# EAGLE design ic-tester (EAGLE 9.6.2)
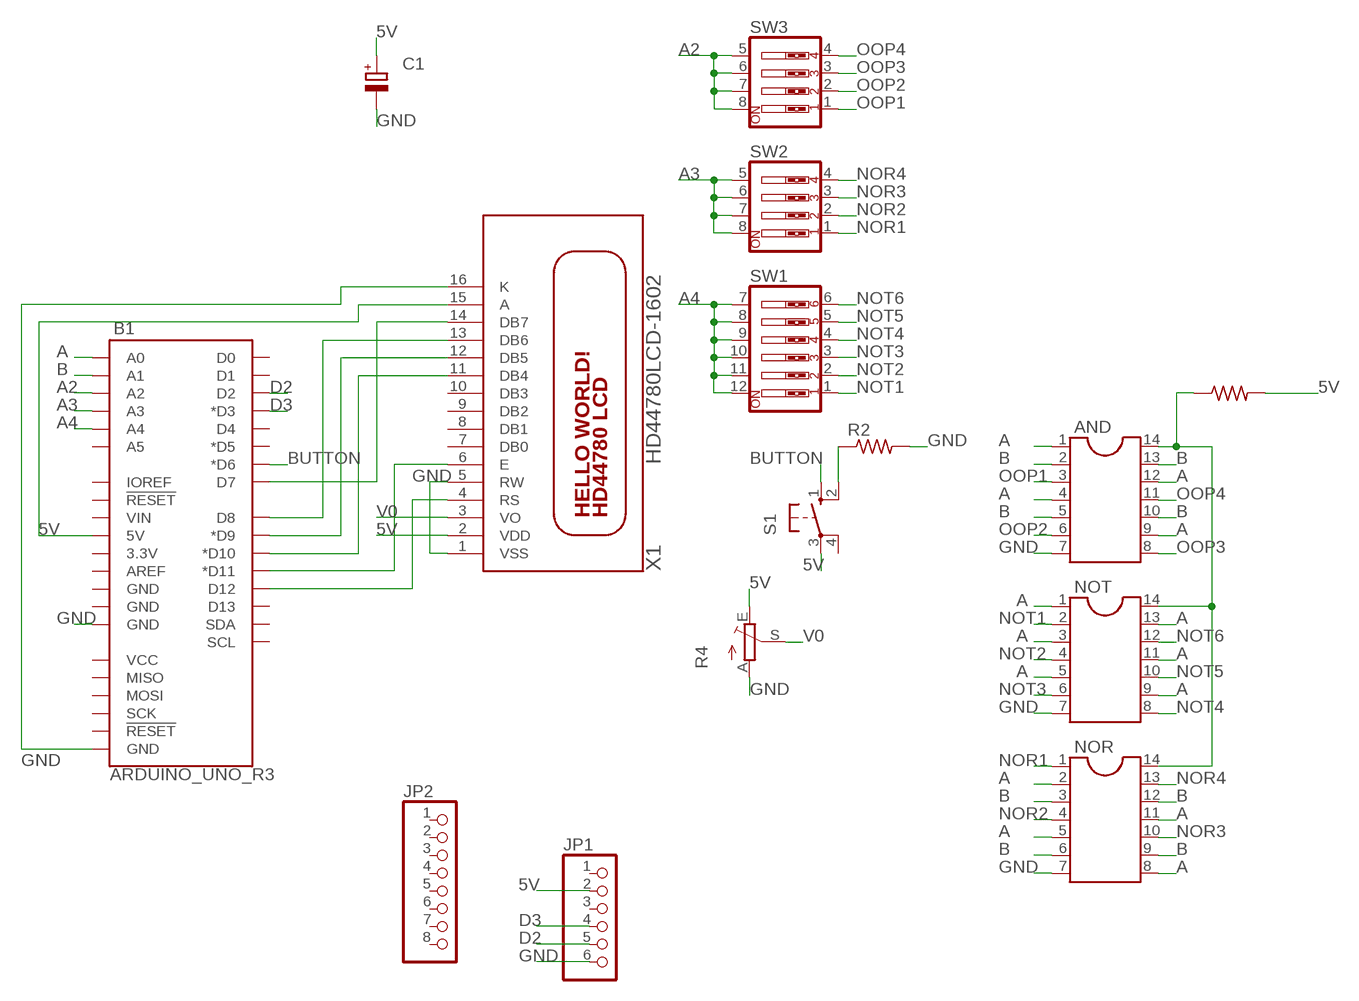
[diagram p0: schematic, sheet 1]

## Parts
AND  DIL14  [DIL14]
B1  ARDUINO_UNO_R3  [ARDUINO_R3]
C1  CPOL-EUE7.5-16  [E7,5-16]
JP1  PINHD-1X6  [1X06]
JP2  PINHD-1X8BIG  [1X08-BIG]
NOR  DIL14  [DIL14]
NOT  DIL14  [DIL14]
R1  R-US_0204/7  [0204/7]
R2  R-US_0204/7  [0204/7]
R4  TRIM_EU-LI10  [LI10]
S1  10-XX  [B3F-10XX]
SW1  SW_DIP-6  [EDG-06]
SW2  SW_DIP-4  [EDG-04]
SW3  SW_DIP-4  [EDG-04]
X1  HD44780LCD-1602  [LCD1602]

## Nets
5V: B1.5V C1.+ JP1.2 R1.2 R4.E S1.3(P) X1.2(VDD) X1.15(A)
A: AND.1 AND.4 AND.9 AND.12 B1.A0 NOR.2 NOR.5 NOR.8 NOR.11 NOT.1 NOT.3 NOT.5 NOT.9 NOT.11 NOT.13
A2: B1.A2 SW3.5 SW3.6 SW3.7 SW3.8
A3: B1.A3 SW2.5 SW2.6 SW2.7 SW2.8
A4: B1.A4 SW1.7 SW1.8 SW1.9 SW1.10 SW1.11 SW1.12
B: AND.2 AND.5 AND.10 AND.13 B1.A1 NOR.3 NOR.6 NOR.9 NOR.12
BUTTON: B1.D6(*D6) S1.1(S)
D2: B1.D2 JP1.5
D3: B1.D3(*D3) JP1.4
GND: AND.7 B1.GND@1(GND) B1.GND@2(GND) C1.- JP1.6 NOR.7 NOT.7 R2.2 R4.A X1.1(VSS) X1.5(RW) X1.16(K)
N$2: B1.D9(*D9) X1.12(DB5)
N$4: B1.D7 X1.14(DB7)
N$5: R2.1 S1.2(S1)
N$30: B1.D8 X1.13(DB6)
N$32: B1.D10(*D10) X1.11(DB4)
N$33: B1.D11(*D11) X1.6(E)
N$34: B1.D12 X1.4(RS)
N$94: AND.14 NOR.14 NOT.14 R1.1
NOR1: NOR.1 SW2.1
NOR2: NOR.4 SW2.2
NOR3: NOR.10 SW2.3
NOR4: NOR.13 SW2.4
NOT1: NOT.2 SW1.1
NOT2: NOT.4 SW1.2
NOT3: NOT.6 SW1.3
NOT4: NOT.8 SW1.4
NOT5: NOT.10 SW1.5
NOT6: NOT.12 SW1.6
OOP1: AND.3 SW3.1
OOP2: AND.6 SW3.2
OOP3: AND.8 SW3.3
OOP4: AND.11 SW3.4
V0: R4.S X1.3(VO)
Unconnected: B1.3.3V B1.A5 B1.AREF B1.D0 B1.D1 B1.D4 B1.D5(*D5) B1.D13 B1.GND@3(GND) B1.GND@4(GND) B1.IOREF B1.MISO B1.MOSI B1.RESET@1(!RESET!) B1.RESET@2(!RESET!) B1.SCK B1.SCL B1.SDA B1.VCC B1.VIN JP1.1 JP1.3 JP2.1 JP2.2 JP2.3 JP2.4 JP2.5 JP2.6 JP2.7 JP2.8 S1.4(P1) X1.7(DB0) X1.8(DB1) X1.9(DB2) X1.10(DB3)

## Library data of the parts
AND NOR NOT = ic-package:DIL14: Dual In Line / Socket
B1 = SparkFun-Boards:ARDUINO_UNO_R3: Arduino R3 Footprint with SPI header Arduino Uno R3 Compatible Footprint. Matches PCB size of the original board. SparkFun Products: SAMD21 Dev Breakout <https://www.sparkfun.com/products/13672> RedBoard <https://www.sparkfun.com/products/12757> R3 Stackable Headers <https://www.sparkfun.com/products/11417>
C1 = resistor:CPOL-EU: POLARIZED CAPACITOR, European symbol
JP1 = adafruit:PINHD-1X6: PIN HEADER
JP2 = adafruit:PINHD-1X8: PIN HEADER
R1 R2 = adafruit:R-US_: RESISTOR, American symbol
R4 = pot:TRIM_EU-: POTENTIOMETER
S1 = switch-omron:10-XX: OMRON SWITCH; MPN: B3F-1000; OC_FARNELL: 176432; OC_NEWARK: 36M3542
SW1 = special:SW_DIP-6: DIP SWITCH
SW2 SW3 = special:SW_DIP-4: DIP SWITCH
X1 = adafruit:HD44780LCD: HD44780 LCD Standard character type LCDs, available in sizes from 8x1 to 40x4!

## Net classes
0 default: width 0.762 mm, drill 0.762 mm, clearance 0.762 mm

## Board
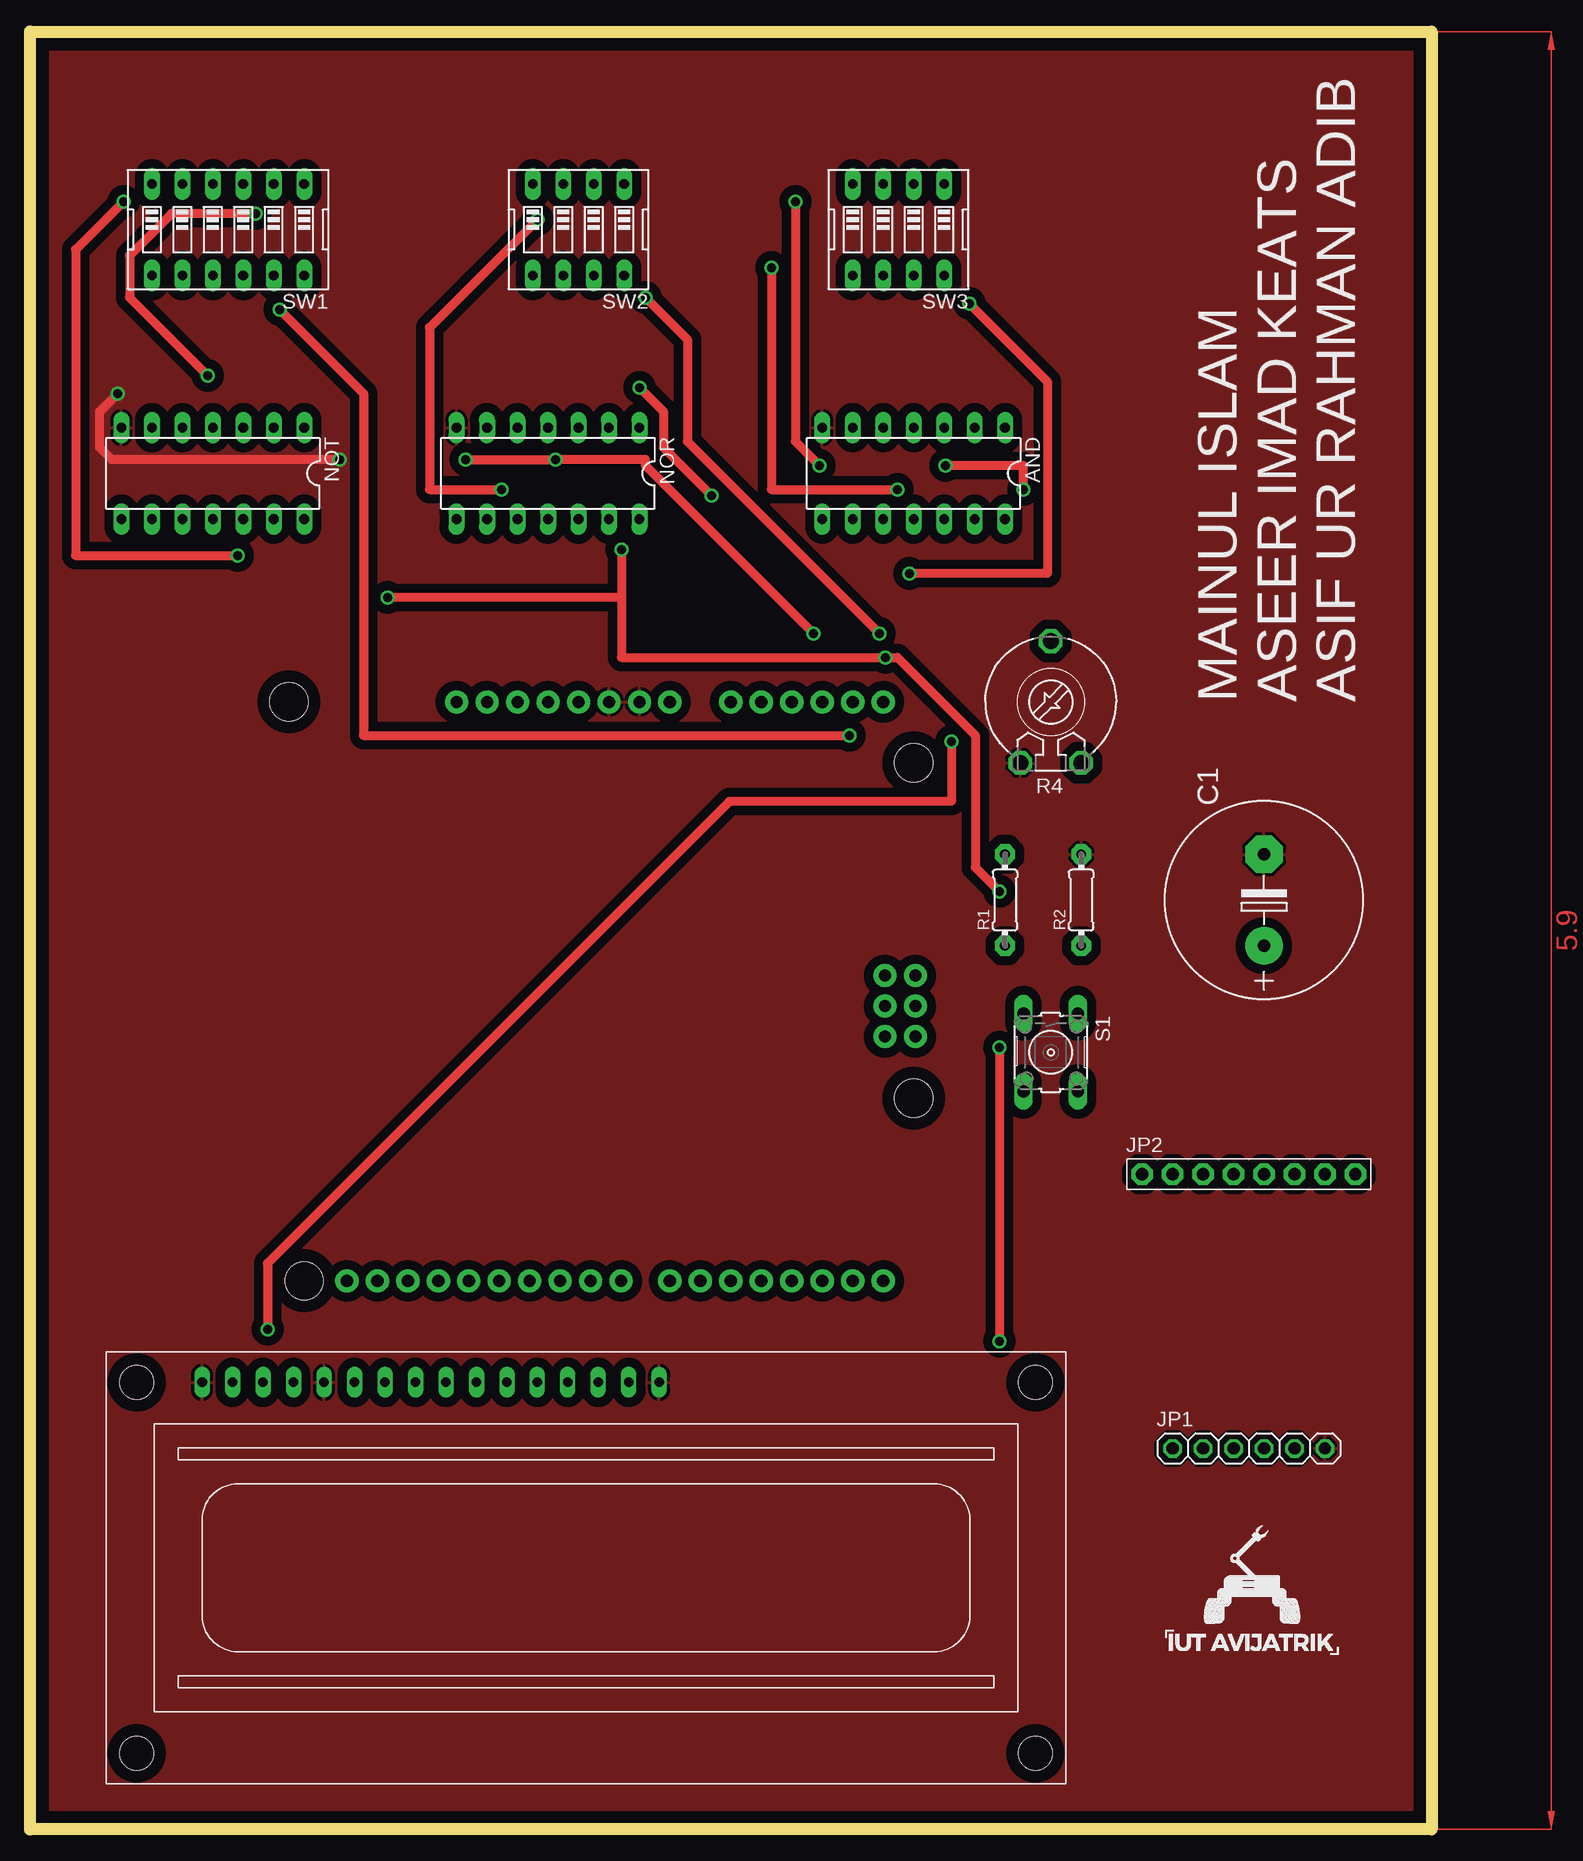
[diagram p1: board, top side]
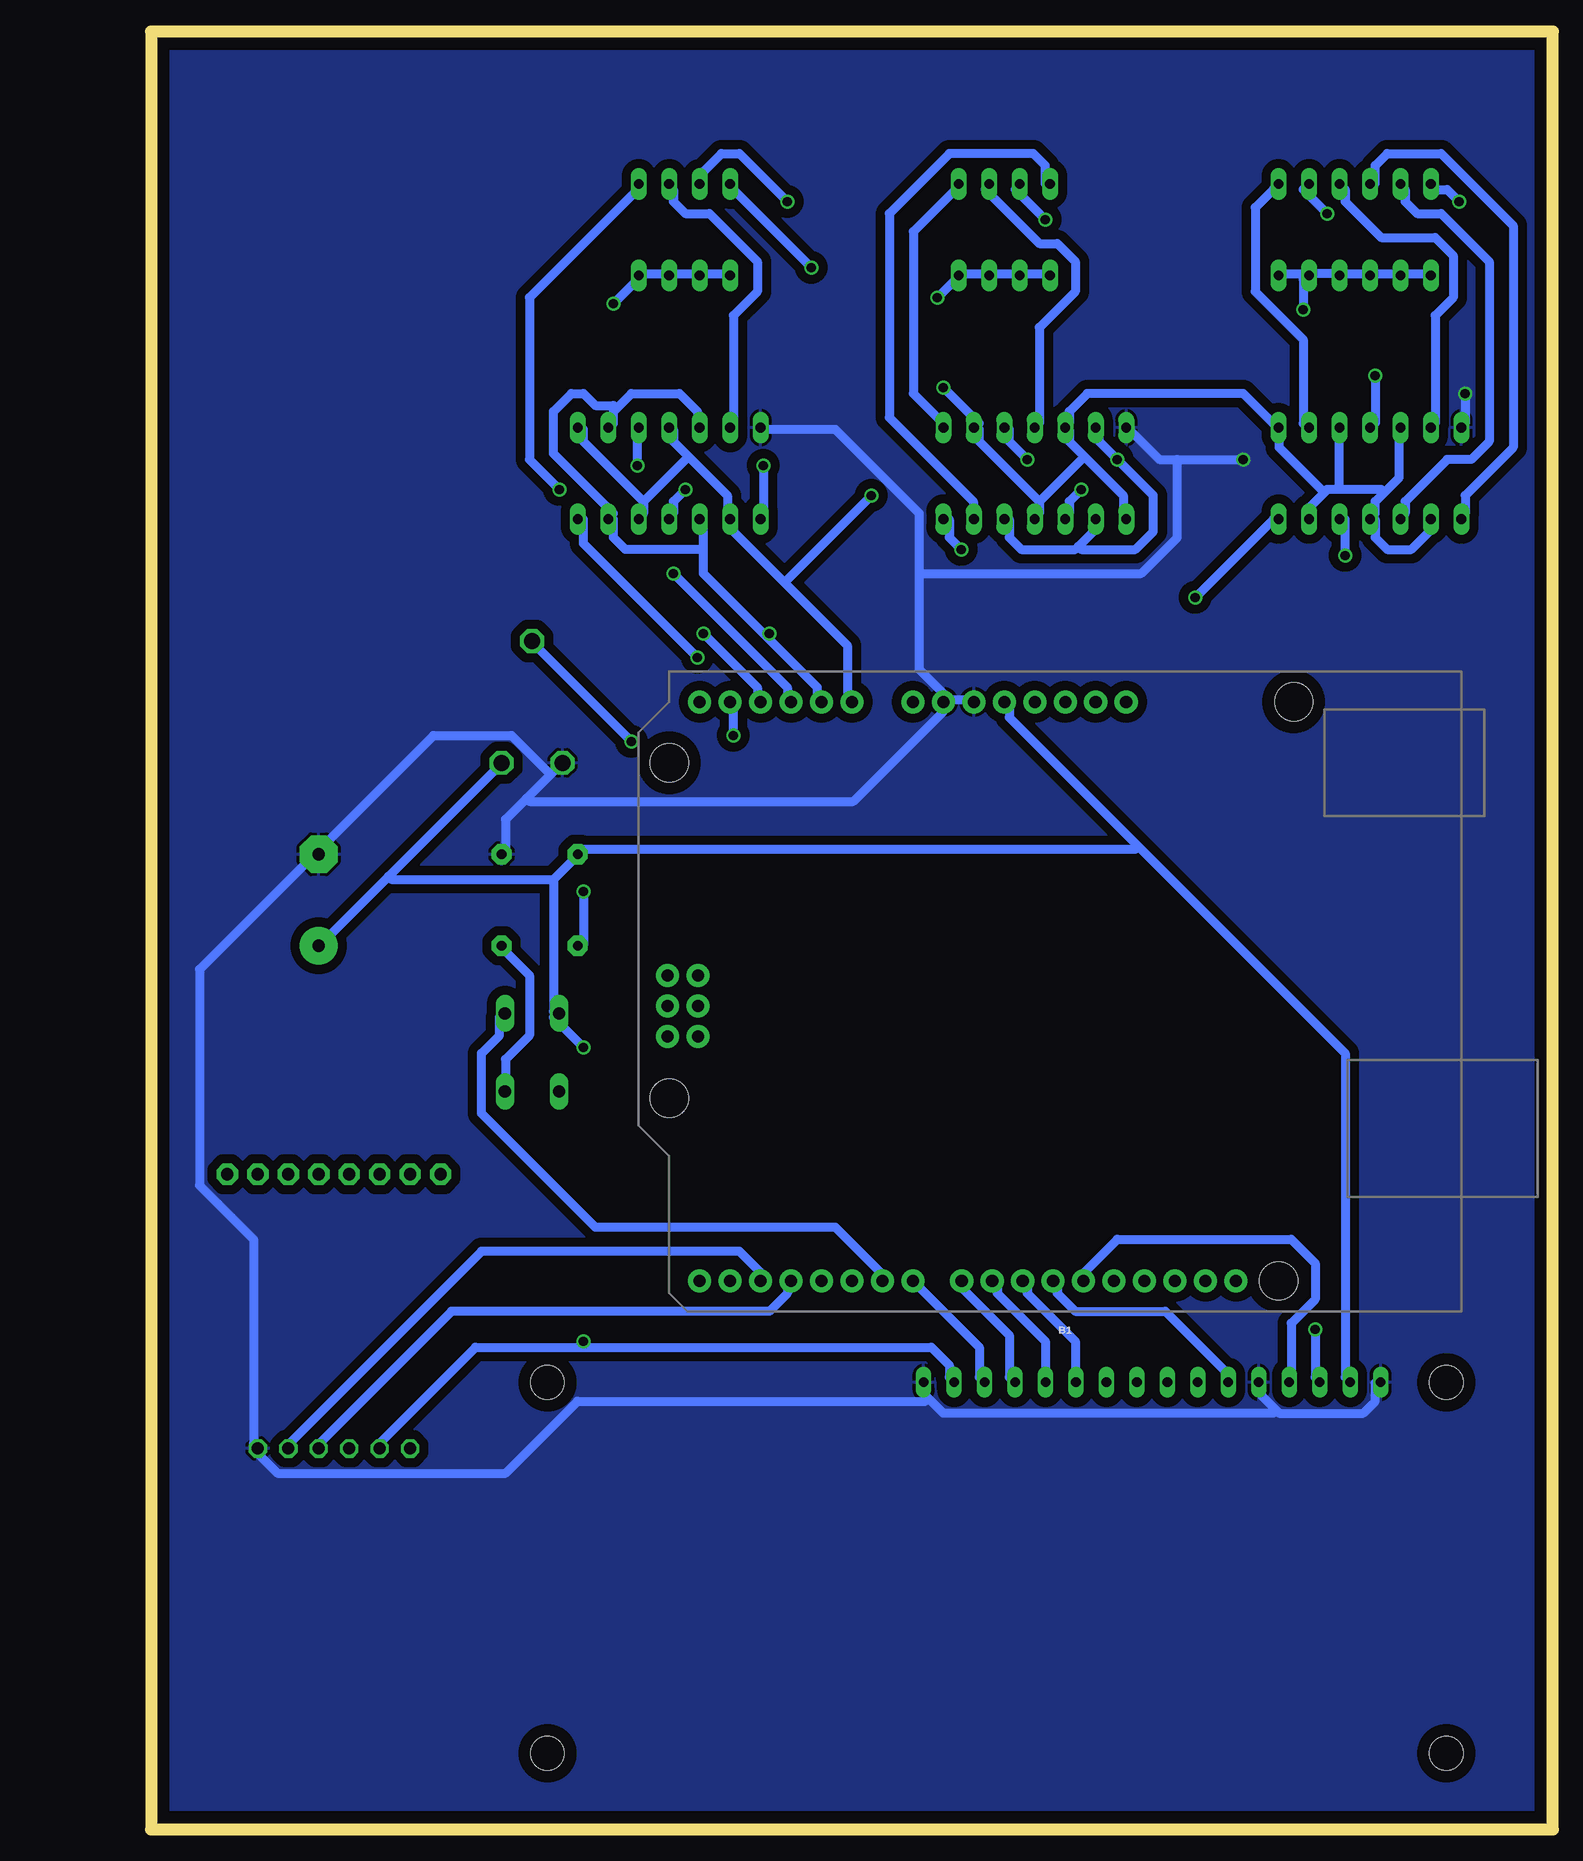
[diagram p2: board, bottom side, seen from below]

Size 116.84 x 149.86 mm. Coordinates in mm from the lower left corner, seen from the top.
Outline: 0,149.86 116.84,149.86 116.84,0 0,0 0,149.86
Copper layers (1*16): Top 0.035mm / dielectric 1.5mm / Bottom 0.035mm
Design rules "default *": minimum track width 30mil, minimum drill 0.45mm, track to track 30mil, track to pad 30mil, pad to pad 30mil, via to via 30mil, smd to smd 30mil, copper to edge 40mil, drill to drill 30mil, minimum pad ring 10mil, minimum via ring 8mil, stop-mask expansion 4mil, vias tented up to drill 0mil, thermal gap 10mil

### Footprints (pad centres in the part's own frame; a part is rotated, then mirrored left to right if it is on the bottom)
DIL14 = drill 0.813 long: 1 -7.62,-3.81; 2 -5.08,-3.81; 3 -2.54,-3.81; 4 0,-3.81; 5 2.54,-3.81; 6 5.08,-3.81; 7 7.62,-3.81; 8 7.62,3.81; 9 5.08,3.81; 10 2.54,3.81; 11 0,3.81; 12 -2.54,3.81; 13 -5.08,3.81; 14 -7.62,3.81
ARDUINO_R3 = drill 1.016 pad 1.93: 3.3V 2.54,-24.13; 5V 5.08,-24.13; A0 17.78,-24.13; A1 20.32,-24.13; A2 22.86,-24.13; A3 25.4,-24.13; A4 27.94,-24.13; A5 30.48,-24.13; AREF -9.144,24.13; D0 30.48,24.13; D1 27.94,24.13; D2 25.4,24.13; D3 22.86,24.13; D4 20.32,24.13; D5 17.78,24.13; D6 15.24,24.13; D7 12.7,24.13; D8 8.636,24.13; D9 6.096,24.13; D10 3.556,24.13; D11 1.016,24.13; D12 -1.524,24.13; D13 -4.064,24.13; GND@1 7.62,-24.13; GND@2 10.16,-24.13; GND@3 -6.604,24.13; GND@4 33.16,-1.32; IOREF -2.54,-24.13; MISO 30.62,3.76; MOSI 33.16,1.22; NC -5.08,-24.13; RESET@1 0,-24.13; RESET@2 30.62,-1.32; SCK 30.62,1.22; SCL -14.224,24.13; SDA -11.684,24.13; VCC 33.16,3.76; VIN 12.7,-24.13 | hole 3.175: -17.78,24.13; 33.02,8.89; 33.02,-19.05; -19.05,-24.13
E7,5-16 = drill 1.016 pad 3.15: + -3.81,0 | drill 1.016 pad 3.15 octagon: - 3.81,0
1X06 = drill 1.016 octagon: 1 -6.35,0; 2 -3.81,0; 3 -1.27,0; 4 1.27,0; 5 3.81,0; 6 6.35,0
1X08-BIG = drill 1.016 pad 1.778 octagon: 1 -8.89,0; 2 -6.35,0; 3 -3.81,0; 4 -1.27,0; 5 1.27,0; 6 3.81,0; 7 6.35,0; 8 8.89,0
0204/7 = drill 0.813 pad 1.676 octagon: 1 -3.81,0; 2 3.81,0
LI10 = drill 1.321 octagon: A -2.54,-5.08; E 2.54,-5.08; S 0,5.08
B3F-10XX = drill 1.016 long: 1 -3.251,2.261; 2 3.251,2.261; 3 -3.251,-2.261; 4 3.251,-2.261
EDG-06 = drill 0.813 long: 1 -6.35,-3.81; 2 -3.81,-3.81; 3 -1.27,-3.81; 4 1.27,-3.81; 5 3.81,-3.81; 6 6.35,-3.81; 7 6.35,3.81; 8 3.81,3.81; 9 1.27,3.81; 10 -1.27,3.81; 11 -3.81,3.81; 12 -6.35,3.81
EDG-04 = drill 0.813 long: 1 -3.81,-3.81; 2 -1.27,-3.81; 3 1.27,-3.81; 4 3.81,-3.81; 5 3.81,3.81; 6 1.27,3.81; 7 -1.27,3.81; 8 -3.81,3.81
LCD1602 = drill 0.8 long: 1 8,33.46; 2 10.54,33.46; 3 13.08,33.46; 4 15.62,33.46; 5 18.16,33.46; 6 20.7,33.46; 7 23.24,33.46; 8 25.78,33.46; 9 28.32,33.46; 10 30.86,33.46; 11 33.4,33.46; 12 35.94,33.46; 13 38.48,33.46; 14 41.02,33.46; 15 43.56,33.46; 16 46.1,33.46 | hole 2.8: 2.54,2.54; 2.54,33.46; 77.46,33.46; 77.46,2.54

### Placement (x,y rotation side)
AND  73.66,113.03 180 top
B1  40.64,69.85 180 bottom
C1  102.87,77.47 90 top
JP1  101.6,31.75 0 top
JP2  101.6,54.61 0 top
NOR  43.18,113.03 180 top
NOT  15.24,113.03 180 top
R1  81.28,77.47 90 top
R2  87.63,77.47 90 top
R4  85.09,93.98 0 top
S1  85.09,64.77 270 top
SW1  16.51,133.35 180 top
SW2  45.72,133.35 180 top
SW3  72.39,133.35 180 top
U$1  [AVIJATRIK]  101.6,17.78 0 top
X1  6.35,3.81 0 top

### Tracks (layer width: path | path; a pad name or v marks a point on that pad's centre or on a via)
5V  (via drill 0.76)
  Top 0.762: v80.81,65.19 v80.81,40.69
  Bottom 0.762: 80.81,40.19 89.81,40.19 97.81,32.19 JP1.2 | 80.81,40.19 51.81,40.19 50.31,38.69 50.31,37.69 X1.15 | 83.31,79.19 83.31,68.19 S1.3 83.31,67.69 v80.81,65.19 | 83.31,79.19 81.31,81.19 R1.2 80.81,81.69 34.81,81.69 34.56,81.94 | 97.06,79.44 102.81,73.69 C1.+ | 97.06,79.44 87.81,88.69 R4.E | 83.31,79.19 96.81,79.19 97.06,79.44 | 34.56,81.94 45.31,92.69 45.31,93.69 B1.5V | 34.56,81.94 17.31,64.69 17.31,37.69 X1.2 | v80.81,40.69 80.81,40.19
A  (via drill 0.76)
  Top 0.762: v56.81,111.19 52.81,115.19 52.81,118.19 v50.81,120.19
  Bottom 0.762: 72.06,114.44 73.31,115.69 73.31,116.69 AND.4 | 72.06,114.44 68.81,111.19 68.81,109.69 AND.9 68.31,109.19 68.31,108.19 64.06,103.94 | 75.81,110.69 75.81,109.69 AND.12 | 72.06,114.44 75.81,110.69 | 75.81,110.69 80.81,115.69 80.81,116.69 AND.1 | 64.06,103.94 58.81,98.69 58.81,94.19 B1.A0 | 39.06,114.44 40.31,115.69 40.31,116.69 NOR.5 40.31,117.19 40.31,118.19 38.81,119.69 25.81,119.69 23.31,117.19 NOT.1 22.81,116.69 22.81,115.19 19.06,111.44 | 39.06,114.44 35.81,111.19 35.81,109.69 NOR.8 | 42.81,110.69 42.81,109.69 NOR.11 | 39.06,114.44 42.81,110.69 | 42.81,110.69 47.81,115.69 47.81,116.69 NOR.2 47.81,117.19 v50.81,120.19 | NOT.9 10.31,109.19 10.31,108.19 11.81,106.69 13.81,106.69 14.81,107.69 14.81,109.19 NOT.11 14.81,109.69 14.81,110.69 14.06,111.44 | 14.06,111.44 12.81,112.69 12.81,116.69 NOT.5 | 19.06,111.44 18.81,111.69 17.81,111.69 | 19.06,111.44 20.31,110.19 20.31,109.69 NOT.13 | 17.81,111.69 14.31,111.69 14.06,111.44 | 17.81,111.69 17.81,116.69 NOT.3 | v56.81,111.19 64.06,103.94
A2  (via drill 0.76)
  Top 0.762: v73.31,104.69 84.81,104.69 84.81,120.69 v78.31,127.19
  Bottom 0.762: SW3.5 68.81,129.69 70.81,129.69 SW3.6 71.31,129.69 73.31,129.69 SW3.7 73.81,129.69 75.81,129.69 SW3.8 76.31,129.19 v78.31,127.19 | v73.31,104.69 63.81,95.19 63.81,94.19 B1.A2
A3  (via drill 0.76)
  Top 0.762: v70.81,99.69 54.81,115.69 54.81,124.19 v51.31,127.69
  Bottom 0.762: SW2.5 42.31,129.69 44.31,129.69 SW2.6 44.81,129.69 46.81,129.69 SW2.7 47.31,129.69 49.31,129.69 SW2.8 49.81,129.19 v51.31,127.69 | v70.81,99.69 66.31,95.19 66.31,94.19 B1.A3
A4  (via drill 0.76)
  Top 0.762: v68.31,91.19 27.81,91.19 27.81,119.69 v20.81,126.69
  Bottom 0.762: SW1.11 20.81,129.69 22.81,129.69 SW1.12 | SW1.7 10.31,129.69 12.31,129.69 SW1.8 12.81,129.69 14.81,129.69 SW1.9 15.31,129.69 17.31,129.69 SW1.10 17.81,129.69 20.31,129.69 SW1.11 | v68.31,91.19 68.31,93.69 B1.A4 | v20.81,126.69 20.81,129.19 SW1.11
B  (via drill 0.76)
  Top 0.762: v36.31,114.19 v43.81,114.19 51.31,114.19 51.31,113.69 v65.31,99.69
  Bottom 0.762: 39.56,106.94 39.81,106.69 44.31,106.69 45.31,107.69 45.31,109.19 NOR.12 | 39.56,106.94 38.31,108.19 38.31,109.19 NOR.9 | NOR.6 37.81,116.69 37.81,115.69 v36.31,114.19 33.31,111.19 33.31,108.19 34.81,106.69 39.31,106.69 39.56,106.94 | v43.81,114.19 45.31,115.69 45.31,116.69 NOR.3 | 78.06,118.44 78.31,118.19 78.31,117.19 AND.2 | 78.06,118.44 76.81,119.69 72.81,119.69 71.31,118.19 71.31,117.19 AND.5 | 70.81,106.69 70.81,104.69 65.56,99.44 | 70.81,106.69 70.81,109.19 AND.10 | 65.56,99.44 61.31,95.19 61.31,94.19 B1.A1 | 70.81,106.69 77.31,106.69 78.31,107.69 78.31,109.19 AND.13 78.31,109.69 83.31,114.69 83.31,118.19 81.81,119.69 80.81,119.69 79.81,118.69 78.31,118.69 78.06,118.44 | v65.31,99.69 65.56,99.44
BUTTON
  Bottom 0.762: S1.1 87.81,67.69 87.81,66.19 89.31,64.69 89.31,59.69 79.81,50.19 59.81,50.19 55.81,46.19 B1.D6
D2
  Bottom 0.762: JP1.5 105.31,32.19 89.31,48.19 67.81,48.19 65.81,46.19 B1.D2
D3
  Bottom 0.762: JP1.4 102.81,32.19 91.81,43.19 65.31,43.19 63.81,44.69 63.81,45.69 B1.D3
GND  (via drill 0.76)
  Top 0.762: v7.31,119.69 5.81,118.19 5.81,115.19 6.81,114.19 v25.81,114.19
  Bottom 0.762: v7.31,119.69 7.31,117.19 NOT.7 | 31.31,114.19 32.81,114.19 35.31,116.69 NOR.7 | 31.31,114.19 v25.81,114.19 | 52.81,104.69 52.81,96.69 50.31,94.19 | 52.81,104.69 52.81,109.69 59.81,116.69 65.81,116.69 AND.7 | 50.31,94.19 48.31,94.19 B1.GND@1 | 50.31,94.19 B1.GND@2 50.81,93.69 50.81,93.19 58.31,85.69 85.31,85.69 85.56,85.94 | 31.31,114.19 31.31,107.69 34.31,104.69 52.81,104.69 | 23.06,34.94 24.31,36.19 24.31,37.19 X1.5 | 23.06,34.94 22.81,34.69 15.81,34.69 14.81,35.69 14.81,37.19 X1.1 | 52.06,35.94 50.81,34.69 23.31,34.69 23.06,34.94 | 52.06,35.94 52.31,36.19 52.31,37.19 X1.16 | 83.56,87.94 82.81,88.69 R4.A | 83.56,87.94 85.56,85.94 | 85.56,85.94 87.31,84.19 87.31,81.69 R2.2 | 83.56,87.94 86.81,91.19 93.31,91.19 102.81,81.69 C1.- 103.31,81.19 112.81,71.69 112.81,53.69 108.31,49.19 108.31,32.19 JP1.6 108.31,31.69 106.31,29.69 87.31,29.69 81.31,35.69 52.31,35.69 52.06,35.94
  pour Bottom: -0.09,149.99 -0.09,-0.01 116.61,-0.01 116.61,149.99
  pour Top: 1.11,148.79 115.71,148.79 115.71,-0.41 1.11,-0.41
N$2
  Bottom 0.762: X1.12 42.31,37.69 42.31,40.69 46.31,44.69 46.31,45.69 B1.D9
N$4
  Bottom 0.762: B1.D7 47.81,40.19 47.81,37.69 X1.14
N$5
  Bottom 0.762: S1.2 87.31,61.69 87.31,64.19 85.31,66.19 85.31,71.19 87.31,73.19 R2.1
N$30
  Bottom 0.762: X1.13 45.31,37.69 45.31,41.19 49.31,45.19 49.31,45.69 B1.D8
N$32
  Bottom 0.762: X1.11 39.81,37.69 39.81,40.69 43.81,44.69 43.81,45.69 B1.D10
N$33
  Bottom 0.762: X1.6 27.31,37.69 27.31,38.19 32.31,43.19 39.81,43.19 41.31,44.69 41.31,45.69 B1.D11
N$34
  Bottom 0.762: X1.4 21.81,37.69 21.81,42.19 19.81,44.19 19.81,47.19 21.81,49.19 36.31,49.19 39.31,46.19 B1.D12
N$94  (via drill 0.76)
  Top 0.762: 49.31,102.69 v29.81,102.69 | v49.31,106.69 49.31,102.69 | 49.31,102.69 49.31,97.69 v71.31,97.69 72.31,97.69 78.81,91.19 78.81,80.19 v80.81,78.19
  Bottom 0.762: v29.81,102.69 23.31,109.19 NOT.14 | v49.31,106.69 50.31,107.69 50.31,109.19 NOR.14 | v71.31,97.69 80.81,107.19 80.81,109.19 AND.14 | v80.81,78.19 80.81,73.69 R1.1
NOR1
  Bottom 0.762: NOR.1 50.81,117.19 53.31,119.69 53.31,133.19 49.81,136.69 SW2.1
NOR2
  Bottom 0.762: NOR.4 42.81,117.19 42.81,125.19 39.81,128.19 39.81,130.69 41.31,132.19 42.81,132.19 47.31,136.69 SW2.2
NOR3  (via drill 0.76)
  Top 0.762: v39.31,111.69 33.31,111.69 33.31,125.19 v42.31,134.19
  Bottom 0.762: v39.31,111.69 40.31,110.69 40.31,109.69 NOR.10 | v42.31,134.19 44.81,136.69 SW2.3
NOR4
  Bottom 0.762: NOR.13 48.31,109.69 48.31,110.69 55.31,117.69 55.31,134.69 50.31,139.69 43.31,139.69 42.31,138.69 42.31,137.19 SW2.4
NOT1
  Bottom 0.762: NOT.2 20.81,117.19 20.81,124.19 24.81,128.19 24.81,135.19 23.31,136.69 SW1.1
NOT2  (via drill 0.76)
  Top 0.762: v14.81,121.19 8.31,127.69 8.31,131.19 11.81,134.69 v18.81,134.69
  Bottom 0.762: v14.81,121.19 14.81,117.19 NOT.4 | v18.81,134.69 20.81,136.69 SW1.2
NOT3
  Bottom 0.762: NOT.6 9.81,117.19 9.81,126.19 8.31,127.69 8.31,131.19 9.81,132.69 14.31,132.69 17.31,135.69 17.31,136.69 SW1.3
NOT4
  Bottom 0.762: NOT.8 7.31,109.69 7.31,111.19 3.31,115.19 3.31,133.69 9.31,139.69 13.81,139.69 14.81,138.69 14.81,137.19 SW1.4
NOT5
  Bottom 0.762: NOT.10 12.31,109.69 12.31,110.69 8.81,114.19 6.81,114.19 5.31,115.69 5.31,130.69 9.31,134.69 11.31,134.69 12.31,135.69 12.31,136.69 SW1.5
NOT6  (via drill 0.76)
  Top 0.762: v17.31,106.19 3.81,106.19 3.81,131.69 v7.81,135.69
  Bottom 0.762: v17.31,106.19 17.31,109.19 NOT.12 | v7.81,135.69 8.81,136.69 9.81,136.69 SW1.6
OOP1  (via drill 0.76)
  Top 0.762: v76.31,113.69 82.81,113.69 v82.81,111.69
  Bottom 0.762: v76.31,113.69 76.31,116.69 AND.3 | v82.81,111.69 85.31,114.19 85.31,127.69 76.31,136.69 SW3.1
OOP2
  Bottom 0.762: AND.6 68.31,117.19 68.31,126.19 66.31,128.19 66.31,130.69 70.31,134.69 72.31,134.69 73.31,135.69 73.31,136.69 SW3.2
OOP3  (via drill 0.76)
  Top 0.762: v65.81,113.69 63.81,115.69 v63.81,135.69
  Bottom 0.762: v65.81,113.69 65.81,109.69 AND.8 | v63.81,135.69 67.81,139.69 69.31,139.69 70.81,138.19 70.81,137.19 SW3.3
OOP4  (via drill 0.76)
  Top 0.762: v72.31,111.69 61.81,111.69 v61.81,130.19
  Bottom 0.762: v72.31,111.69 73.31,110.69 73.31,109.69 AND.11 | v61.81,130.19 68.31,136.69 SW3.4
V0  (via drill 0.76)
  Top 0.762: v19.81,41.69 19.81,47.19 58.31,85.69 76.81,85.69 v76.81,90.69
  Bottom 0.762: v19.81,41.69 19.81,37.69 X1.3 | v76.81,90.69 84.81,98.69 R4.S
(copper drawn outside any net)
  shapes: Top area x1

### Text on the board
tNames: MAINUL ISLAM / ASEER IMAD KEATS / ASIF UR RAHMAN ADIB